# EAGLE schematic PIC32DIP (EAGLE 5.11)
PROJECT: PIC32DIP
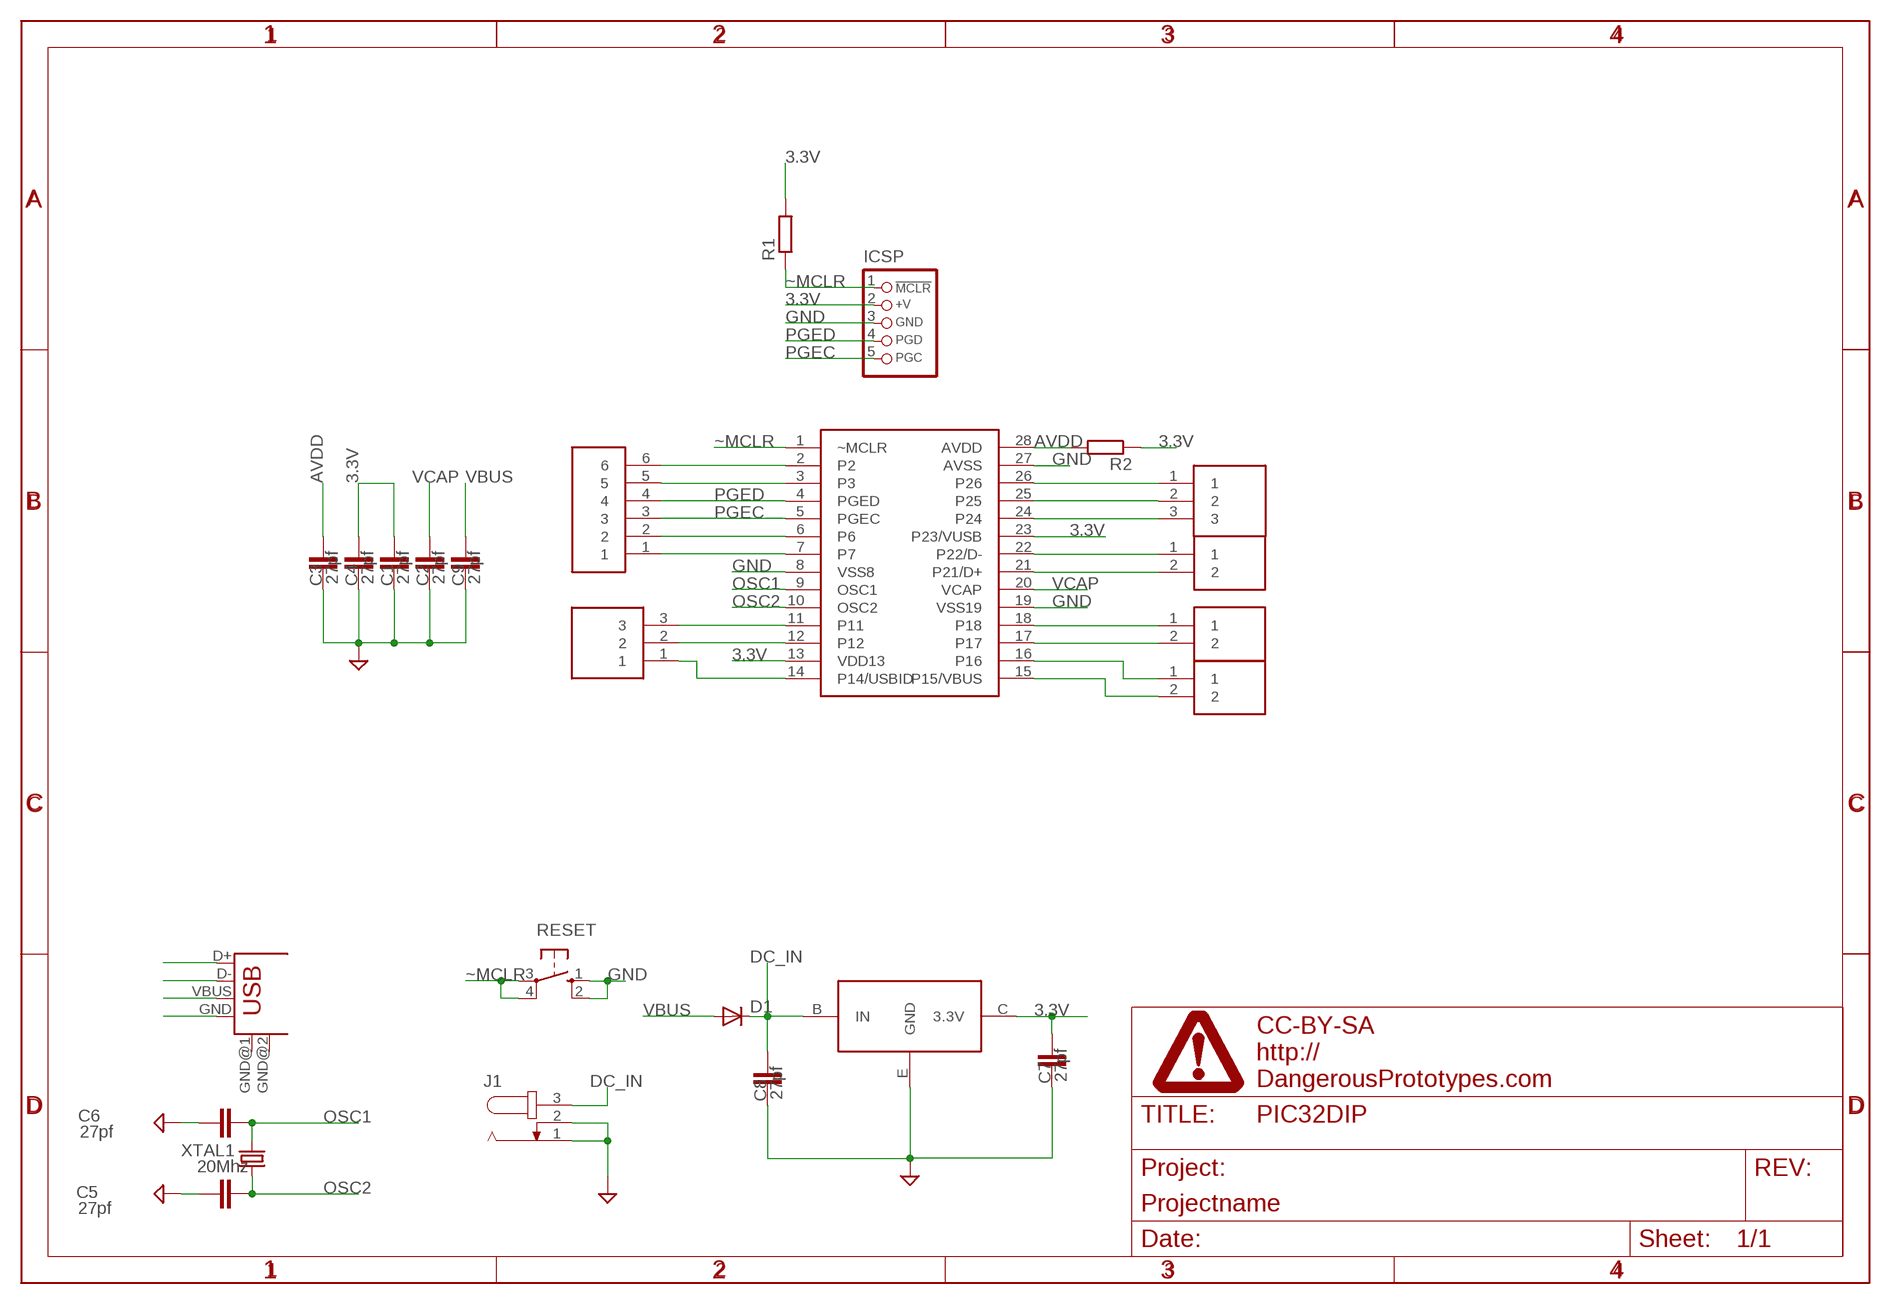
[diagram p0: schematic, sheet 1]

## Parts
C1  27pf  CAPDECOUPLING  [DEC]
C2  27pf  CAPDECOUPLING  [DEC]
C3  27pf  CAPDECOUPLING  [DEC]
C4  27pf  CAPDECOUPLING  [DEC]
C5  27pf  CAPDECOUPLING  [DEC]
C6  27pf  CAPDECOUPLING  [DEC]
C7  27pf  CAPDECOUPLING  [DEC]
C8  27pf  CAPDECOUPLING  [DEC]
C9  27pf  CAPDECOUPLING  [DEC]
D1  1N4148DO35-7  [DO35-7]
ICSP  HEADER_PRG_PIC_ICSPB  [HEADER_PRG_1X05_ICSP_B]
J1  JACK-PLUG0  [SPC4077]
R1  RESISTORTH  [RTH025W]
R2  RESISTORTH  [RTH025W]
RESET  10-XX  [B3F-10XX]
U$1  PIC32DIP  [SOCKET-28-3]
U$2  DINA4_L  [DP_LOGO]
U$3  HEADER1X3PTH  [M1X3]
U$4  HEADER1X2PTH  [M1X2]
U$5  HEADER1X6PTH  [M1X6]
U$6  HEADER1X3PTH  [M1X3]
U$7  HEADER1X2PTH  [M1X2]
U$8  HEADER1X2PTH  [M1X2]
USB  USB  USB-B-H  [USB-B-H]
VR1  MCP1701-3.3  [TO92-EBC]
XTAL1  20Mhz  CRYSTALHC49U70  [HC49U70]

## Nets
3.3V: C1.1 C4.1 C7.1 ICSP.2(+V) R1.2 R2.1 U$1.13(VDD13) U$1.23(P23/VUSB) VR1.C(3.3V)
AVDD: C3.1 R2.2 U$1.28(AVDD)
D+: U$1.21(P21/D+) U$4.2 USB.D+
D-: U$1.22(P22/D-) U$4.1 USB.D-
DC_IN: C8.1 D1.C J1.3 VR1.B(IN)
GND: C1.2 C2.2 C3.2 C4.2 C5.2 C6.2 C7.2 C8.2 C9.2 ICSP.3(GND) J1.1 J1.2 RESET.1(S) RESET.2(S1) U$1.8(VSS8) U$1.19(VSS19) U$1.27(AVSS) USB.GND VR1.E(GND)
N$1: U$1.2 U$5.6
N$2: U$1.3 U$5.5
N$3: U$1.6 U$5.2
N$4: U$1.7 U$5.1
N$5: U$1.11 U$6.3
N$7: U$1.12 U$6.2
N$8: U$1.14(P14/USBID) U$6.1
N$9: U$1.16 U$8.1
N$10: U$1.17 U$7.2
N$11: U$1.18 U$7.1
N$12: U$1.26 U$3.1
N$13: U$1.25 U$3.2
N$14: U$1.24 U$3.3
OSC1: C6.1 U$1.9(OSC1) XTAL1.2
OSC2: C5.1 U$1.10(OSC2) XTAL1.1
PGEC: ICSP.5(PGC) U$1.5(PGEC) U$5.3
PGED: ICSP.4(PGD) U$1.4(PGED) U$5.4
VBUS: C9.1 D1.A U$1.15(P15/VBUS) U$8.2 USB.VBUS
VCAP: C2.1 U$1.20(VCAP)
~MCLR: ICSP.1(/MCLR) R1.1 RESET.3(P) RESET.4(P1) U$1.1(~MCLR)
Unconnected: USB.GND@1(GND) USB.GND@2(GND)

## Library data of the parts
C1-C9 = dp_devices:CAP
D1 = diode:1N4148: DIODE high speed (Philips)
ICSP = DP2:HEADER_PRG_PIC_ICSP: 5-pin PIC In Circuit Serial Programming header
J1 = con-jack:JACK-PLUG: DC POWER JACK Power Jack, DC, Right Angle, Through Hole, Rated 5A at 16VDC, PC Terminals Distributor: Farnell (www.Farnell.de) Drawing: 84N1161.pdf / 84N1162.pdf Manufacturer: SPC Technology (www.spctechnology.com) Type: SPC4077 / SPC 4078; OC_FARNELL: unknown; OC_NEWARK: unknown
R1 R2 = dp_devices:RESISTOR
RESET = switch-omron:10-XX: OMRON SWITCH; MPN: B3F-1000; OC_FARNELL: 176432; OC_NEWARK: 36M3542
U$1 = fica2:PIC32DIP
U$2 = DP2:DINA4_L: A4 DP frame Standard Dangerous Prototypes schematic frame. Automagically adds the DP logo and standard texts to the PCB Use the atrribute in the schematic editor to change the fields.; FF1: fulfillment by; FF2: Seeed Studio; FF3: www.seeedstudio.com; LICENSE: CC-BY-SA; PROJECT: Projectname; URL1: http://; URL2: DangerousPrototypes.com
U$3 U$6 = DP2:HEADER1X3
U$4 U$7 U$8 = DP2:HEADER1X2
U$5 = DP2:HEADER1X6
USB = con-usb-2:USB: USB Connectors
VR1 = fica2:MCP1701-3.3
XTAL1 = crystal:CRYSTAL: CRYSTAL; OC_FARNELL: unknown; OC_NEWARK: unknown